# Altium schematic sheet OTHERS.SchDoc
size A4
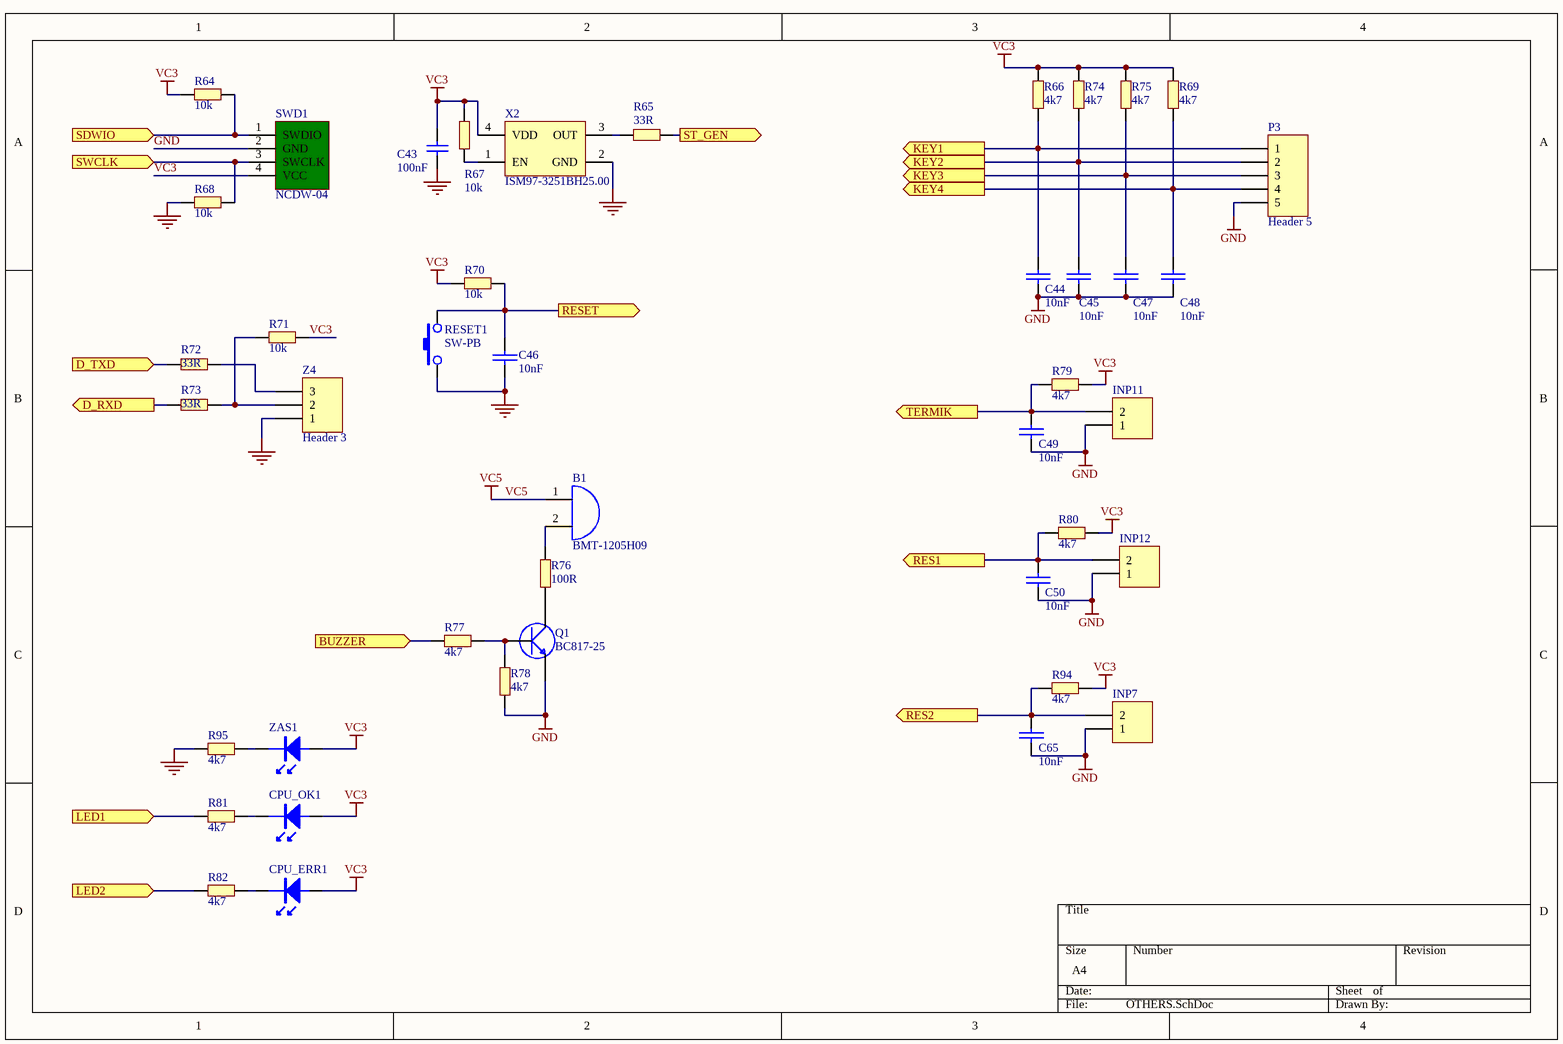
[diagram p0: OTHERS.SchDoc]

## Parts
B1  BMT-1205H09  [BMT-1205H09]
C43  100nF  [0603C]
C44  10nF  [0603C]
C45  10nF  [0603C]
C46  10nF  [0603C]
C47  10nF  [0603C]
C48  10nF  [0603C]
C49  10nF  [0603C]
C50  10nF  [0603C]
C65  10nF  [0603C]
CPU_ERR1  LED0805  [0603DR]  (value not drawn)
CPU_OK1  green  [0603DG]  (value not drawn)
INP7  Header 2  [JST-XH-2Y-2.54]  (value not drawn)
INP11  Header 2  [JST-XH-2Y-2.54]  (value not drawn)
INP12  Header 2  [JST-XH-2Y-2.54]  (value not drawn)
P3  Header 5  [JST-B5B-XH-A]
Q1  BC817-25  [SOT23-3Q]
R64  10k  [0603R]
R65  33R  [0603R]
R66  4k7  [0603R]
R67  10k  [0603R]
R68  10k  [0603R]
R69  4k7  [0603R]
R70  10k  [0603R]
R71  10k  [0603R]
R72  33R  [0603R]
R73  33R  [0603R]
R74  4k7  [0603R]
R75  4k7  [0603R]
R76  100R  [0603R]
R77  4k7  [0603R]
R78  4k7  [0603R]
R79  4k7  [0603R]
R80  4k7  [0603R]
R81  4k7  [0603R]
R82  4k7  [0603R]
R94  4k7  [0603R]
R95  4k7  [0603R]
RESET1  SW-PB  [DTSM31N_2]
SWD1  NCDW-04  [PIN4]
X2  ISM97-3251BH25.00  [GEN_SMD1_1]
Z4  Header 3  [PIN3]
ZAS1  green  [0603DG]  (value not drawn)

## Ports
BUZZER (in), D_RXD (out), D_TXD (in), KEY1 (out), KEY2 (out), KEY3 (out), KEY4 (out), LED1 (in), LED2 (in), RES1 (out), RES2 (out), RESET (out), SDWIO (in), ST_GEN (out), SWCLK (in), TERMIK (out)

## Nets
GND: C43.1 C44.2 C45.2 C46.2 C47.2 C48.2 C49.2 C50.2 C65.2 INP7.1 INP11.1 INP12.1 P3.5 Q1.E R68.1 R78.2 R95.2 RESET1.1 SWD1.2(GND) X2.2(GND) Z4.1
VC3: C43.2 CPU_ERR1.A CPU_OK1.A R64.1 R66.2 R67.1 R69.2 R70.1 R71.2 R74.2 R75.2 R79.2 R80.2 R94.2 SWD1.4(VCC) X2.4(VDD) ZAS1.A
VC5: B1.1
BUZZER: R77.2 ; port BUZZER
D_RXD: R73.2 ; port D_RXD
D_TXD: R72.2 ; port D_TXD
KEY1: C44.1 P3.1 R66.1 ; port KEY1
KEY2: C45.1 P3.2 R74.1 ; port KEY2
KEY3: C47.1 P3.3 R75.1 ; port KEY3
KEY4: C48.1 P3.4 R69.1 ; port KEY4
LED1: R81.2 ; port LED1
LED2: R82.2 ; port LED2
RES1: C50.1 INP12.2 R80.1 ; port RES1
RES2: C65.1 INP7.2 R94.1 ; port RES2
RESET: C46.1 R70.2 RESET1.2 ; port RESET
SDWIO: R64.2 SWD1.1(SWDIO) ; port SDWIO
ST_GEN: R65.2 ; port ST_GEN
SWCLK: R68.2 SWD1.3(SWCLK) ; port SWCLK
TERMIK: C49.1 INP11.2 R79.1 ; port TERMIK
NetB1_2: B1.2 R76.1
NetCPU_ERR1_K: CPU_ERR1.K R82.1
NetCPU_OK1_K: CPU_OK1.K R81.1
NetQ1_B: Q1.B R77.1 R78.1
NetQ1_C: Q1.C R76.2
NetR65_1: R65.1 X2.3(OUT)
NetR67_2: R67.2 X2.1(EN)
NetR71_1: R71.1 R73.1 Z4.2
NetR72_1: R72.1 Z4.3
NetR95_1: R95.1 ZAS1.K

## Library data of the parts
B1 = BUZZER
C43 = Cap_100nF_X7R_10%_0402: Capacitor,100nF,16V,X7R,10%,0402,YAGEO; Manuf_Part_1: CC0402KRX7R7BB104; Revision: July-2002: Re-released for DXP Platform.; Value: 100nF; Order: CC0402KRX7R7BB104; Manuf_1: YAGEO
C44-C50 C65 = CAP: Capacitor
CPU_ERR1 CPU_OK1 ZAS1 = LED1206
INP7 INP11 INP12 = Header 2: Header, 2-Pin; LatestRevisionDate: 17-Jul-2002; LatestRevisionNote: Re-released for DXP Platform.; Publisher: Altium Limited
P3 = Header 5: Header, 5-Pin; LatestRevisionDate: 17-Jul-2002; LatestRevisionNote: Re-released for DXP Platform.; Publisher: Altium Limited
Q1 = S9013SMD
R64-R82 R94 R95 = RES3
SWD1 = SW_CON: Header, 4-Pin; LatestRevisionDate: 17-Jul-2002; LatestRevisionNote: Re-released for DXP Platform.; Publisher: Altium Limited
X2 = OSC_25M_NZ2520SB: Oscillator 25.00Mhz, -+50PPM, 3.3V, Temp -55 to +125°C; Manuf_Part_1: NZ2520SB 25MHz END4869B; Manuf_1: NDK; Manuf_Part_2: KC2520B25.0000C10E00; Manuf_2: AVX Corp/Kyocera Corp; ECCN_US/EU: EAR99/NEC; Ref St: 9157031; Provided: ST; Dostawca: TME; Order: *; Dostawca.Symbol: ISM97-3251BH25.00
Z4 = Header 3: Header, 3-Pin; LatestRevisionDate: 17-Jul-2002; LatestRevisionNote: Re-released for DXP Platform.; Publisher: Altium Limited